# EAGLE design Meshtastic-DIY_v2.3_TTGO-T18-V30 (EAGLE 9.6.2)
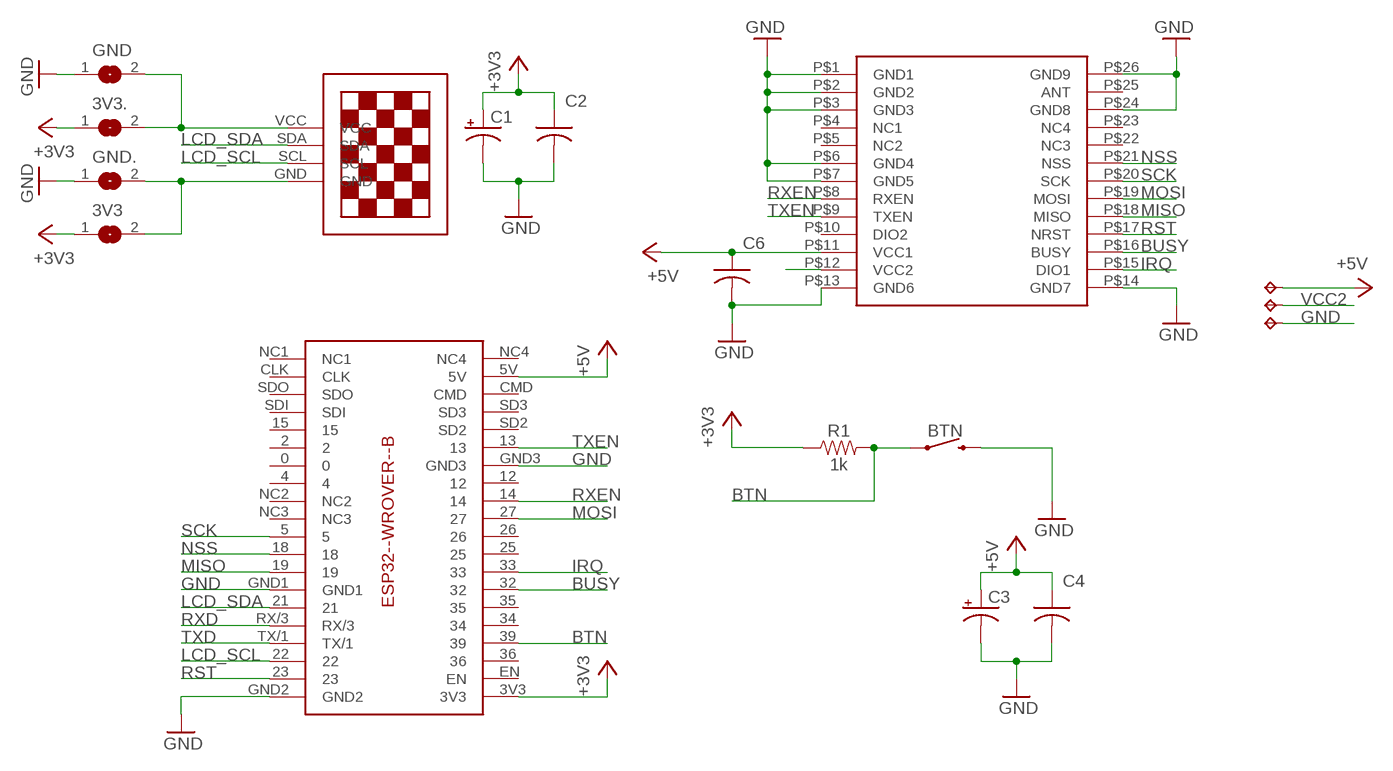
[diagram p0: schematic, sheet 1]

## Parts
3V3  SJ  [SJ]
3V3.  SJ  [SJ]
BTN  MOMENTARY-SWITCH-SPST-SMD-5.2MM  [TACTILE_SWITCH_SMD_5.2MM]
C1  100uF  100UF-POLAR-EIA7343-10V-10%(TANT)  [EIA7343]
C2  100nF  C-US025-024X044  [C025-024X044]
C3  100uF  100UF-POLAR-EIA7343-10V-10%(TANT)  [EIA7343]
C4  100nF  C-US025-024X044  [C025-024X044]
C6  100nF  C-US025-024X044  [C025-024X044]
GND  SJ  [SJ]
GND.  SJ  [SJ]
R1  1k  1KOHM-VERT-1/4W-1%  [AXIAL-0.1]
TP1  TPTP14SQ  [TP14SQ]
TP2  TPTP14SQ  [TP14SQ]
TP3  TPTP14SQ  [TP14SQ]
U$1  13"OLED13"OLED  [1.3"OLED]
U$2  E22-XXXMXXS  [E22-XXXMXXS]
U$4  TTGO-T18_V3  [TTGO-T18_V3]

## Nets
+3V3: 3V3.1 3V3..1 C1.A(+) C2.1 R1.P$1 U$4.3V3
+5V: C3.A(+) C4.1 C6.1 TP1.TP U$2.P$11(VCC1) U$4.5V
BTN: BTN.1 R1.P$2 U$4.39
BUSY: U$2.P$16(BUSY) U$4.32
GND: BTN.3 C1.C(-) C2.2 C3.C(-) C4.2 C6.2 GND.1 GND..1 TP3.TP U$2.P$1(GND1) U$2.P$2(GND2) U$2.P$3(GND3) U$2.P$6(GND4) U$2.P$7(GND5) U$2.P$13(GND6) U$2.P$14(GND7) U$2.P$24(GND8) U$2.P$26(GND9) U$4.GND1 U$4.GND2 U$4.GND3
IRQ: U$2.P$15(DIO1) U$4.33
LCD_SCL: U$1.SCL U$4.22
LCD_SDA: U$1.SDA U$4.21
MISO: U$2.P$18(MISO) U$4.19
MOSI: U$2.P$19(MOSI) U$4.27
N$2: 3V3.2 GND..2 U$1.GND
N$4: 3V3..2 GND.2 U$1.VCC
NSS: U$2.P$21(NSS) U$4.18
RST: U$2.P$17(NRST) U$4.23
RXD: U$4.RX/3
RXEN: U$2.P$8(RXEN) U$4.14
SCK: U$2.P$20(SCK) U$4.5
TXD: U$4.TX/1
TXEN: U$2.P$9(TXEN) U$4.13
VCC2: TP2.TP U$2.P$12(VCC2)
Unconnected: U$2.P$4(NC1) U$2.P$5(NC2) U$2.P$10(DIO2) U$2.P$22(NC3) U$2.P$23(NC4) U$2.P$25(ANT) U$4.0 U$4.2 U$4.4 U$4.12 U$4.15 U$4.25 U$4.26 U$4.34 U$4.35 U$4.36 U$4.CLK U$4.CMD U$4.EN U$4.NC1 U$4.NC2 U$4.NC3 U$4.NC4 U$4.SD2 U$4.SD3 U$4.SDI U$4.SDO

## Library data of the parts
3V3 3V3. GND GND. = jumper:SJ: SMD solder JUMPER
BTN = SparkFun-Switches:MOMENTARY-SWITCH-SPST: Momentary Switch (Pushbutton) - SPST Normally-open (NO) SPST momentary switches (buttons, pushbuttons). Variants PTH-12MM - 12mm square, through-hole Momentary Pushbutton Switch - 12mm Square <https://www.sparkfun.com/products/9190> (COM-09190) PTH-6.0MM, PTH-6.0MM-KIT - 6.0mm square, through-hole Mini Pushbutton Switch <https://www.sparkfun.com/products/97> (COM-00097) KIT package intended for soldering kit's - only one side of pads' copper is exposed. PTH-RIGHT-ANGLE-KIT - Right-angle, through-hole Right Angle Tactile Button <https://www.sparkfun.com/products/10791> - Used on SparkFun BigTime Watch Kit <https://www.sparkfun.com/products/11734> SMD-12MM - 12mm square, surface-mount Tactile Button - SMD (12mm) <https://www.sparkfun.com/products/12993> (COM-12993) Used on SparkFun PicoBoard <https://www.sparkfun.com/products/11888> SMD-4.5MM - 4.5mm Square Trackball Switch Used on SparkFun Blackberry Trackballer Breakout <https://www.sparkfun.com/products/13169> SMD-4.6MMX2.8MM - 4.60mm x 2.80mm, surface mount Used on SparkFun SAMD21 Mini Breakout <https://www.sparkfun.com/products/13664> SMD-5.2MM, SMD-5.2-REDUNDANT - 5.2mm square, surface-mount Mini Pushbutton Switch - SMD <https://www.sparkfun.com/products/8720> (COM-08720) Used on Arduino Pro Mini <https://www.sparkfun.com/products/11114> REDUNDANT package connects both switch circuits together SMD-6.0X3.5MM - 6.0 x 3.5mm, surface mount Momentary Reset Switch SMD <https://www.sparkfun.com/products/8229> (COM-08229) SMD-6.2MM-TALL - 6.2mm square, surface mount Tactile Button - SMD (6mm) <https://www.sparkfun.com/products/12992> Used on SparkFun Digital Sandbox <https://www.sparkfun.com/products/12651> SMD-RIGHT-ANGLE - Right-angle, surface mount Used on SparkFun Block for Intel® Edison - Arduino <https://www.sparkfun.com/products/13036>; PROD_ID: SWCH-08247; SF_SKU: COM-08720
C1 C3 = SparkFun-Capacitors:100UF-POLAR: 100µF polarized capacitors A capacitor is a passive two-terminal electrical component used to store electrical energy temporarily in an electric field.; PROD_ID: CAP-07890
C2 C4 C6 = adafruit:C-US: CAPACITOR, American symbol
R1 = SparkFun-Resistors:1KOHM: 1kΩ resistor A resistor is a passive two-terminal electrical component that implements electrical resistance as a circuit element. Resistors act to reduce current flow, and, at the same time, act to lower voltage levels within circuits. - Wikipedia; PROD_ID: RES-12182
TP1-TP3 = testpad:TP: Test pad
U$1 = 13oled:13"OLED
U$2 = E22-XXXMXXS:E22-XXXMXXS
U$4 = TTGO-T8:TTGO-T18_V3

## Board
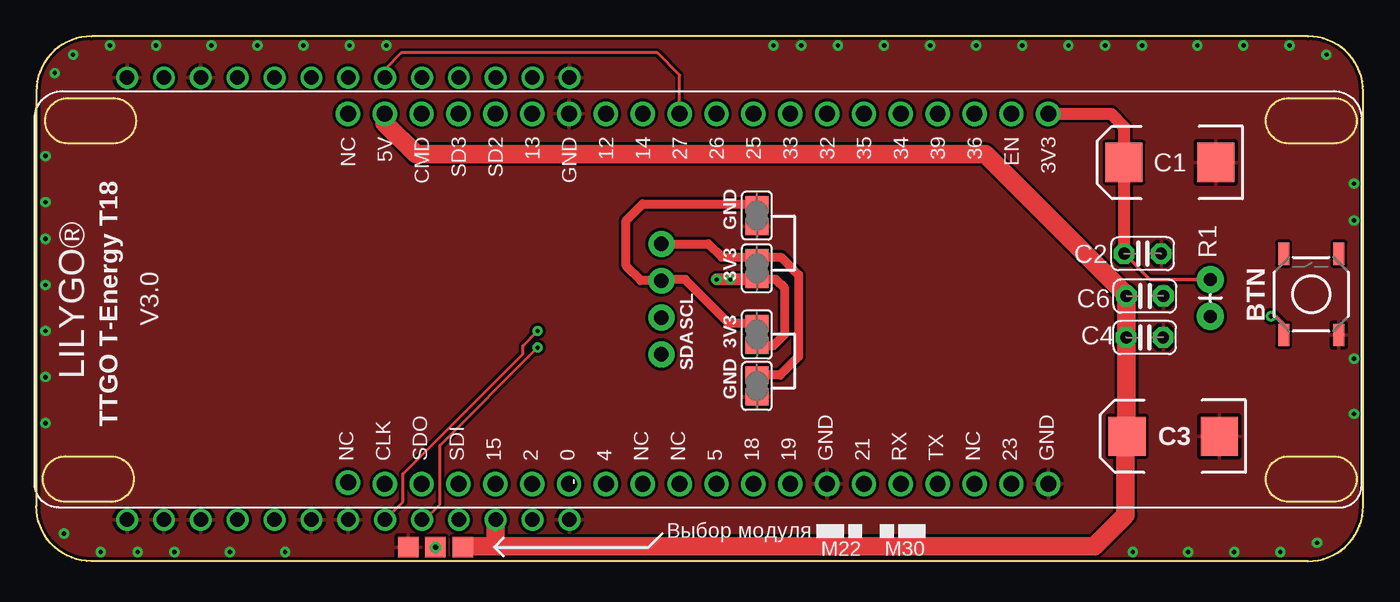
[diagram p1: board, top side]
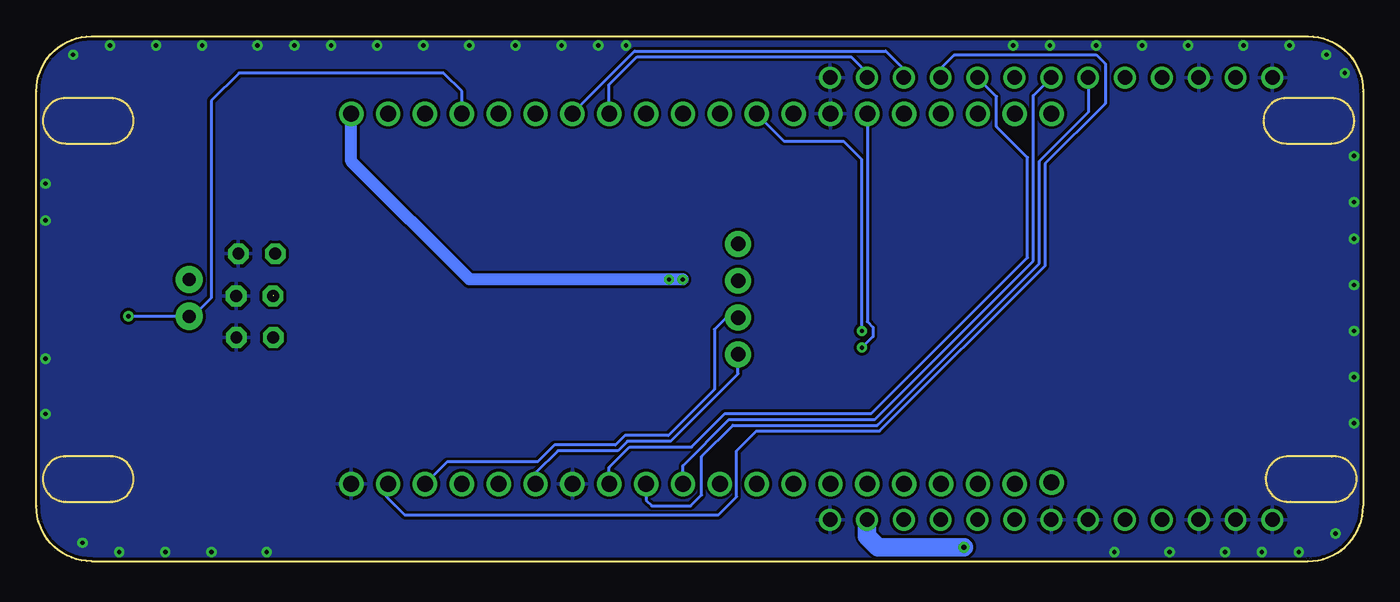
[diagram p2: board, bottom side, seen from below]

Size 91.44 x 36.2 mm. Coordinates in mm from the lower left corner, seen from the top.
Outline: 87.63,0 arc90 91.44,3.81 91.44,32.38 arc90 87.63,36.2 3.81,36.2 arc90 0,32.38 0,3.81 arc90 3.81,0 87.63,0
Copper layers (1*16): Top 0.035mm / dielectric 1.5mm / Bottom 0.035mm
Design rules "default *": minimum track width 0.2mm, minimum drill 0.25mm, track to track 0.2mm, track to pad 0.2mm, pad to pad 0.2mm, via to via 0.2mm, smd to smd 0.2mm, copper to edge 0.2mm, drill to drill 0.2mm, minimum pad ring 10mil, minimum via ring 8mil, stop-mask expansion 2mil, vias tented up to drill 0.35mm, thermal gap 10mil
Milling: 16 lines

### Footprints (pad centres in the part's own frame; a part is rotated, then mirrored left to right if it is on the bottom)
SJ = smd 1.168 x 1.6: 1 -0.762,0; 2 0.762,0
TACTILE_SWITCH_SMD_5.2MM = smd 1.524 x 0.762: 1 -2.794,1.905; 2 2.794,1.905; 3 -2.794,-1.905; 4 2.794,-1.905
EIA7343 = smd 2.55 x 2.7: A 3.17,0; C -3.17,0
C025-024X044 = drill 0.813 pad 1.422 octagon: 1 -1.27,0; 2 1.27,0
AXIAL-0.1 = drill 0.9 pad 1.88: P$1 -1.27,0; P$2 1.27,0
TP14SQ = smd 1.4 x 1.4: TP 0,0
1.3"OLED = drill 1 pad 1.778: GND 2.54,0; SCL 5.08,0; SDA 7.62,0; VCC 0,0
E22-XXXMXXS = drill 1: P$1 -15.24,13.97; P$2 -15.24,11.43; P$3 -15.24,8.89; P$4 -15.24,6.35; P$5 -15.24,3.81; P$6 -15.24,1.27; P$7 -15.24,-1.27; P$8 -15.24,-3.81; P$9 -15.24,-6.35; P$10 -15.24,-8.89; P$11 -15.24,-11.43; P$12 -15.24,-13.97; P$13 -15.24,-16.51; P$14 15.24,-16.51; P$15 15.24,-13.97; P$16 15.24,-11.43; P$17 15.24,-8.89; P$18 15.24,-6.35; P$19 15.24,-3.81; P$20 15.24,-1.27; P$21 15.24,1.27; P$22 15.24,3.81; P$23 15.24,6.35; P$24 15.24,8.89; P$25 15.24,11.43; P$26 15.24,13.97
TTGO-T18_V3 = drill 1.1 pad 1.676: 0 -12.807,10.16; 2 -12.807,12.7; 3V3 12.713,-22.86; 4 -12.807,7.62; 5 -12.807,0; 5V 12.713,22.86; 12 12.713,7.62; 13 12.713,12.7; 14 12.713,5.08; 15 -12.807,15.24; 18 -12.807,-2.54; 19 -12.807,-5.08; 21 -12.807,-10.16; 22 -12.807,-17.78; 23 -12.807,-20.32; 25 12.713,-2.54; 26 12.713,0; 27 12.713,2.54; 32 12.713,-7.62; 33 12.713,-5.08; 34 12.713,-12.7; 35 12.713,-10.16; 36 12.713,-17.78; 39 12.713,-15.24; CLK -12.807,22.86; CMD 12.713,20.32; EN 12.713,-20.32; GND1 -12.807,-7.62; GND2 -12.807,-22.86; GND3 12.713,10.16; NC1 -12.707,25.4; NC2 -12.807,5.08; NC3 -12.807,2.54; NC4 12.713,25.4; RX/3 -12.807,-12.7; SD2 12.713,15.24; SD3 12.713,17.78; SDI -12.807,17.78; SDO -12.807,20.32; TX/1 -12.807,-15.24

### Placement (x,y rotation side)
3V3  49.66,15.63 90 top
3V3.  49.66,20.2 90 top
BTN  87.86,18.41 90 top
C1  78.13,27.5 180 top
C2  76.24,21.21 0 top
C3  78.34,8.62 180 top
C4  76.38,15.43 0 top
C6  76.4,18.29 0 top
GND  49.66,12.08 90 top
GND.  49.66,23.83 90 top
R1  80.91,18.16 270 top
TP1  29.38,0.98 0 top
TP2  27.51,0.98 0 top
TP3  25.63,0.98 0 top
U$1  43.08,21.88 270 bottom
U$2  20.23,18.1 90 top
U$4  46.87,18.14 90 top

### Tracks (layer width: path | path; a pad name or v marks a point on that pad's centre or on a via)
+3V3  (via drill 0.3)
  Top 0.254: C2.1 76.75,19.43 R1.P$1
  Top 0.61: 3V3.1 50.79,14.87 51.59,15.67 51.59,18.8 50.95,19.43 3V3..1
  Top 0.813: C2.1 74.97,27.48 C1.A 74.96,29.95 74.05,30.85 U$4.3V3 | 3V3..1 v46.9,19.43
  Bottom 0.813: v46.9,19.43 v47.83,19.43 61.59,19.43 69.73,27.57 U$4.3V3
+5V  (2 unrouted)
  Top 0.813: 75.18,8.6 C3.A | 75.17,15.37 C4.1
  Top 1.27: 75.12,18.35 65.41,28.07 26.16,28.07 24.01,30.21 U$4.5V | 75.12,15.41 75.17,15.37 | 75.11,8.68 C4.1 75.11,18.27 | 75.11,8.68 75.18,8.6 | 75.11,8.68 75.06,8.62 75.06,3.17 72.9,1.02 31.57,1.02 | TP1.TP 29.42,1.02 31.57,1.02 | U$2.P$11 31.65,1.1 31.57,1.02
BTN  (via drill 0.3)
  Top 0.2: BTN.1 85.95,16.41 85.47,16.89 v85.09,16.89
  Bottom 0.2: v85.09,16.89 R1.P$2 80.65,16.89 79.38,18.16 79.38,31.75 77.47,33.66 63.37,33.66 62.11,32.4 U$4.39
BUSY
  Bottom 0.2: U$2.P$16 31.65,33.94 32.89,35.18 50.2,35.18 54.49,30.89 U$4.32
GND  (via drill 0.3)
  other vias: 9.53,0.64 6.99,0.64 4.45,0.64 1.91,1.91 0.64,9.53 0.64,12.7 0.64,15.88 0.64,19.05 0.64,22.22 0.64,24.77 0.64,27.94 1.27,33.66 2.54,34.92 5.08,35.56 8.26,35.56 12.06,35.56 15.24,35.56 18.41,35.56 21.59,35.56 24.13,35.56 50.8,35.56 52.71,35.56 55.25,35.56 58.42,35.56 61.59,35.56 64.77,35.56 67.94,35.56 71.12,35.56 73.66,35.56 76.2,35.56 80.01,35.56 83.18,35.56 86.36,35.56 88.9,34.92 90.8,26.04 90.8,23.49 90.8,13.97 90.8,10.16 88.27,1.27 85.72,0.64 82.55,0.64 79.38,0.64 75.56,0.64 13.34,0.64 17.14,0.64
  pour Top: -0.38,37.34 -0.38,-0.13 91.69,-0.13 91.69,37.34
  pour Bottom: -0.38,36.7 -0.38,-0.13 91.69,-0.13 91.69,36.7
IRQ
  Bottom 0.2: U$4.33 51.95,32.86 50.04,34.78 35.29,34.78 34.2,33.69 U$2.P$15
LCD_SCL
  Bottom 0.2: U$4.22 63.13,6.86 56.9,6.86 55.73,8.02 51.53,8.02 50.88,8.67 47.89,8.67 44.71,11.86 44.71,15.99 43.89,16.8 U$1.SCL
LCD_SDA
  Bottom 0.2: U$4.21 57.03,6.08 55.5,7.62 51.37,7.62 50.71,8.27 47.72,8.27 43.08,12.92 U$1.SDA
MISO
  Bottom 0.2: U$4.19 51.95,6.47 50.55,7.87 46.29,7.87 43.98,10.18 33.89,10.18 23.13,20.94 23.13,27.83 25.27,29.97 25.27,32.04 U$2.P$18
MOSI
  Top 0.2: U$4.27 44.33,33.52 42.8,35.05 25.15,35.05 24.04,33.94 U$2.P$19
N$2
  Top 0.508: 49.62,24.64 GND..2
  Top 0.61: 3V3.2 47.74,16.4 44.71,19.43 43.16,19.43 U$1.GND 41.66,19.34 40.64,20.36 40.64,23.49 41.79,24.64 49.62,24.64
N$4
  Top 0.61: GND.2 51.25,12.84 52.52,14.11 52.52,19.74 51.3,20.96 3V3..2 47.24,20.96 46.32,21.88 U$1.VCC
NSS
  Bottom 0.2: U$4.18 49.41,4.2 49.02,3.81 46.36,3.81 45.59,4.57 45.59,7.22 43.43,9.38 33.49,9.38 22.33,20.54 22.33,27.58 18.92,30.99 18.92,33.31 U$2.P$21
RST
  Bottom 0.2: U$2.P$17 29.11,33.98 28.19,34.91 18.4,34.91 17.78,34.29 17.78,31.56 21.93,27.41 21.93,20.37 33.32,8.98 41.82,8.98 43.18,7.62 43.18,4.45 44.45,3.17 66.04,3.17 67.31,4.45 67.31,5.21 U$4.23
RXEN  (via drill 0.3)
  Top 0.2: U$2.P$8 25.27,4.1 25.27,6.03 33.53,14.28 33.53,14.86 v34.54,15.88
  Bottom 0.2: U$4.14 39.9,28.96 35.81,28.96 34.57,27.72 34.57,15.91 v34.54,15.88
SCK
  Bottom 0.2: U$4.5 46.87,6.59 43.69,9.78 33.66,9.78 22.73,20.7 22.73,32.11 U$2.P$20
TXEN  (via drill 0.3)
  Top 0.2: U$2.P$9 26.74,2.86 27.81,3.94 27.81,8 v34.54,14.73
  Bottom 0.2: U$4.13 34.17,16.52 33.78,16.13 33.78,15.49 v34.54,14.73
VCC2  (via drill 0.35)
  Bottom 1.27: U$2.P$12 34.2,1.72 33.45,0.98 TP2.TP
  other vias: 27.51,0.98

### Text on the board
tNames: NC | 5V | CMD | SD3 | SD2 | 13 | GND | 12 | 14 | 27 | 26 | 25 | 33 | 32 | 35 | 34 | 39 | 36 | EN | 3V3 | TTGO T-Energy T18 | LILYGO® | GND | V3.0 | 3V3 | SCL | 3V3 | SDA | GND | NC | CLK | SDO | SDI | 15 | 2 | 0 | 4 | NC | NC | 5 | 18 | 19 | GND | 21 | RX | TX | NC | 23 | GND | Выбор модуля | M22 | M30